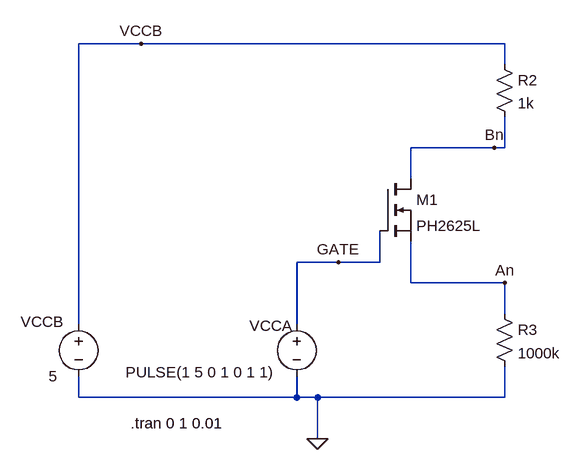
[diagram p0: schematic pca9306_pass_transistor.asc]
pca9306_pass_transistor.asc, the LTspice schematic file:
Version 4
SHEET 1 1096 680
WIRE 128 -128 32 -128
WIRE 688 -128 128 -128
WIRE 688 -96 688 -128
WIRE 672 32 544 32
WIRE 688 32 688 -16
WIRE 688 32 672 32
WIRE 544 80 544 32
WIRE 432 208 368 208
WIRE 496 208 496 160
WIRE 496 208 432 208
WIRE 544 240 544 176
WIRE 688 240 544 240
WIRE 688 288 688 240
WIRE 32 304 32 -128
WIRE 368 304 368 208
WIRE 32 416 32 384
WIRE 368 416 368 384
WIRE 368 416 32 416
WIRE 400 416 368 416
WIRE 688 416 688 368
WIRE 688 416 400 416
WIRE 400 480 400 416
FLAG 400 480 0
FLAG 128 -128 VCCB
FLAG 672 32 Bn
FLAG 688 240 An
FLAG 432 208 GATE
SYMBOL voltage 368 288 R0
WINDOW 0 -73 18 Left 2
WINDOW 3 -149 105 Bottom 2
SYMATTR InstName VCCA
SYMATTR Value PULSE(1 5 0 1 0 1 1)
SYMBOL voltage 32 288 R0
WINDOW 0 -89 12 Left 2
WINDOW 3 -46 96 Left 2
SYMATTR InstName VCCB
SYMATTR Value 5
SYMBOL res 672 -112 R0
SYMATTR InstName R2
SYMATTR Value 1k
SYMBOL res 672 272 R0
SYMATTR InstName R3
SYMATTR Value 1000k
SYMBOL nmos 496 80 R0
SYMATTR InstName M1
SYMATTR Value PH2625L
TEXT 112 456 Left 2 !.tran 0 1 0.01

The netlist it stands for:
* pca9306_pass_transistor.asc
VCCA GATE 0 PULSE(1 5 0 1 0 1 1)
VCCB VCCB 0 5
R2 VCCB Bn 1k
R3 An 0 1000k
M1 Bn GATE An An PH2625L
.model NMOS NMOS
.model PMOS PMOS
.lib standard.mos
.tran 0 1 0.01
.backanno
.end